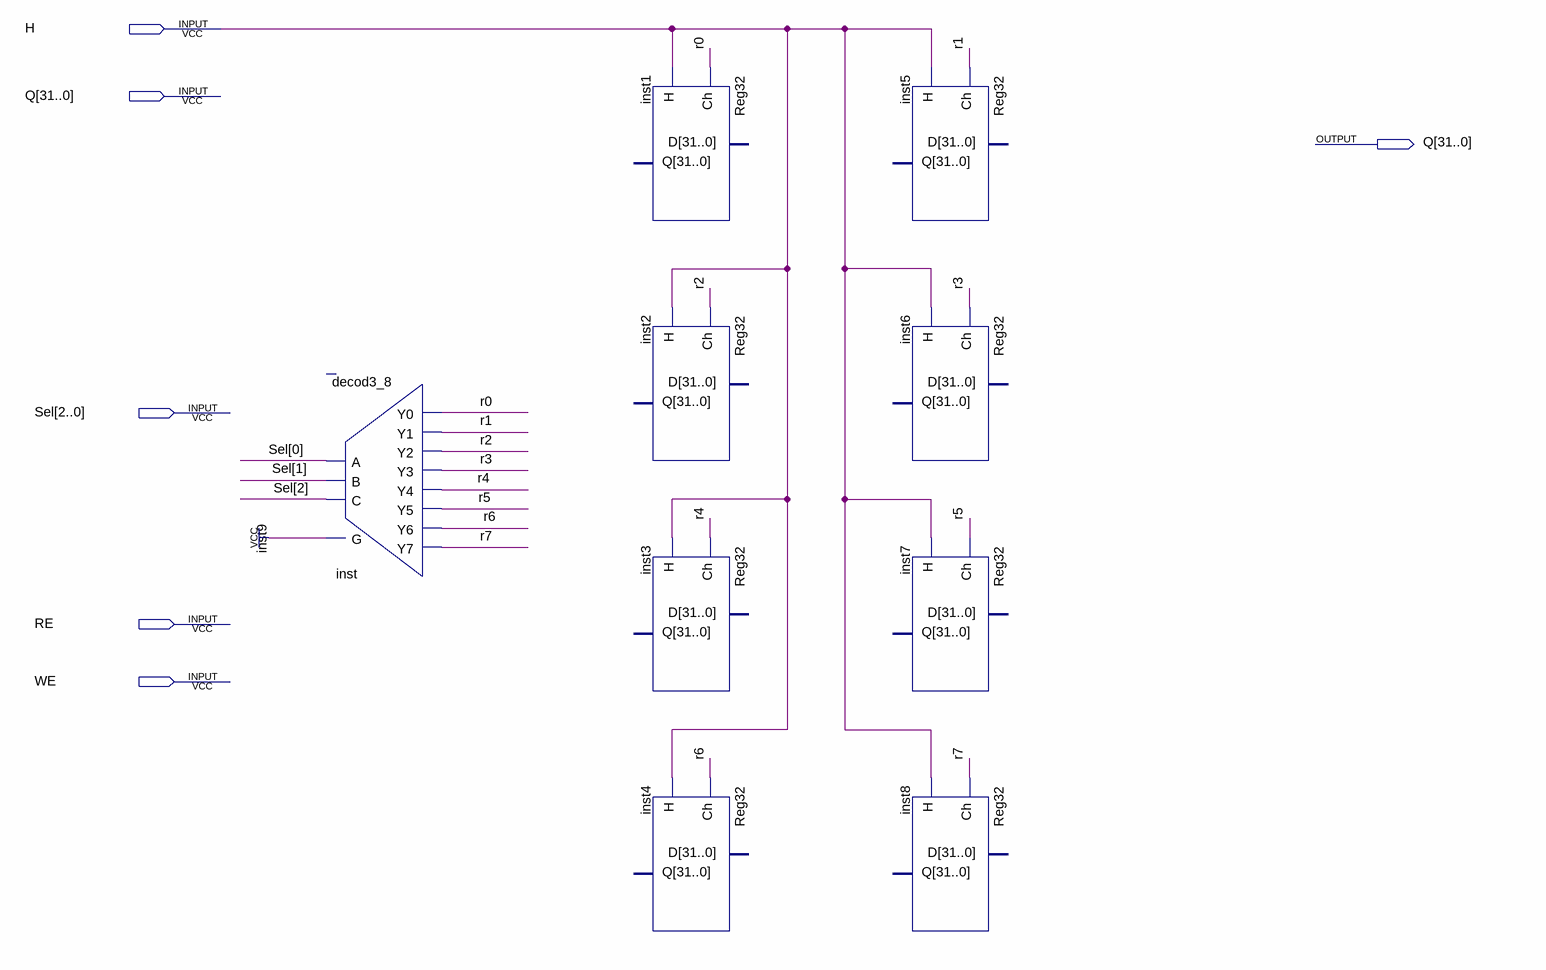
[diagram p0: schematic sheet]
// Quartus schematic 8words.bdf as structural Verilog: 9 symbols, 6 pins
module \8words  (
  input  H,
  inout  [31:0] Q,
  input  [2:0] Sel,
  input  RE,
  input  WE
);

  wire r0, r1, r2, r3, r4, r5, r6, r7;

  decod3_8 inst (
    .G(1'b1), .A(Sel[0]), .B(Sel[1]), .C(Sel[2]), .Y0(r0), .Y1(r1), .Y2(r2), .Y3(r3), .Y4(r4), .Y5(r5),
    .Y6(r6), .Y7(r7));
  Reg32 inst1 (.H(H), .Ch(r0));  // open: D, Q
  Reg32 inst2 (.H(H), .Ch(r2));  // open: D, Q
  Reg32 inst3 (.H(H), .Ch(r4));  // open: D, Q
  Reg32 inst4 (.H(H), .Ch(r6));  // open: D, Q
  Reg32 inst5 (.H(H), .Ch(r1));  // open: D, Q
  Reg32 inst6 (.H(H), .Ch(r3));  // open: D, Q
  Reg32 inst7 (.H(H), .Ch(r5));  // open: D, Q
  Reg32 inst8 (.H(H), .Ch(r7));  // open: D, Q
endmodule
